# Altium project a5800-BONDPogo.PrjPcb
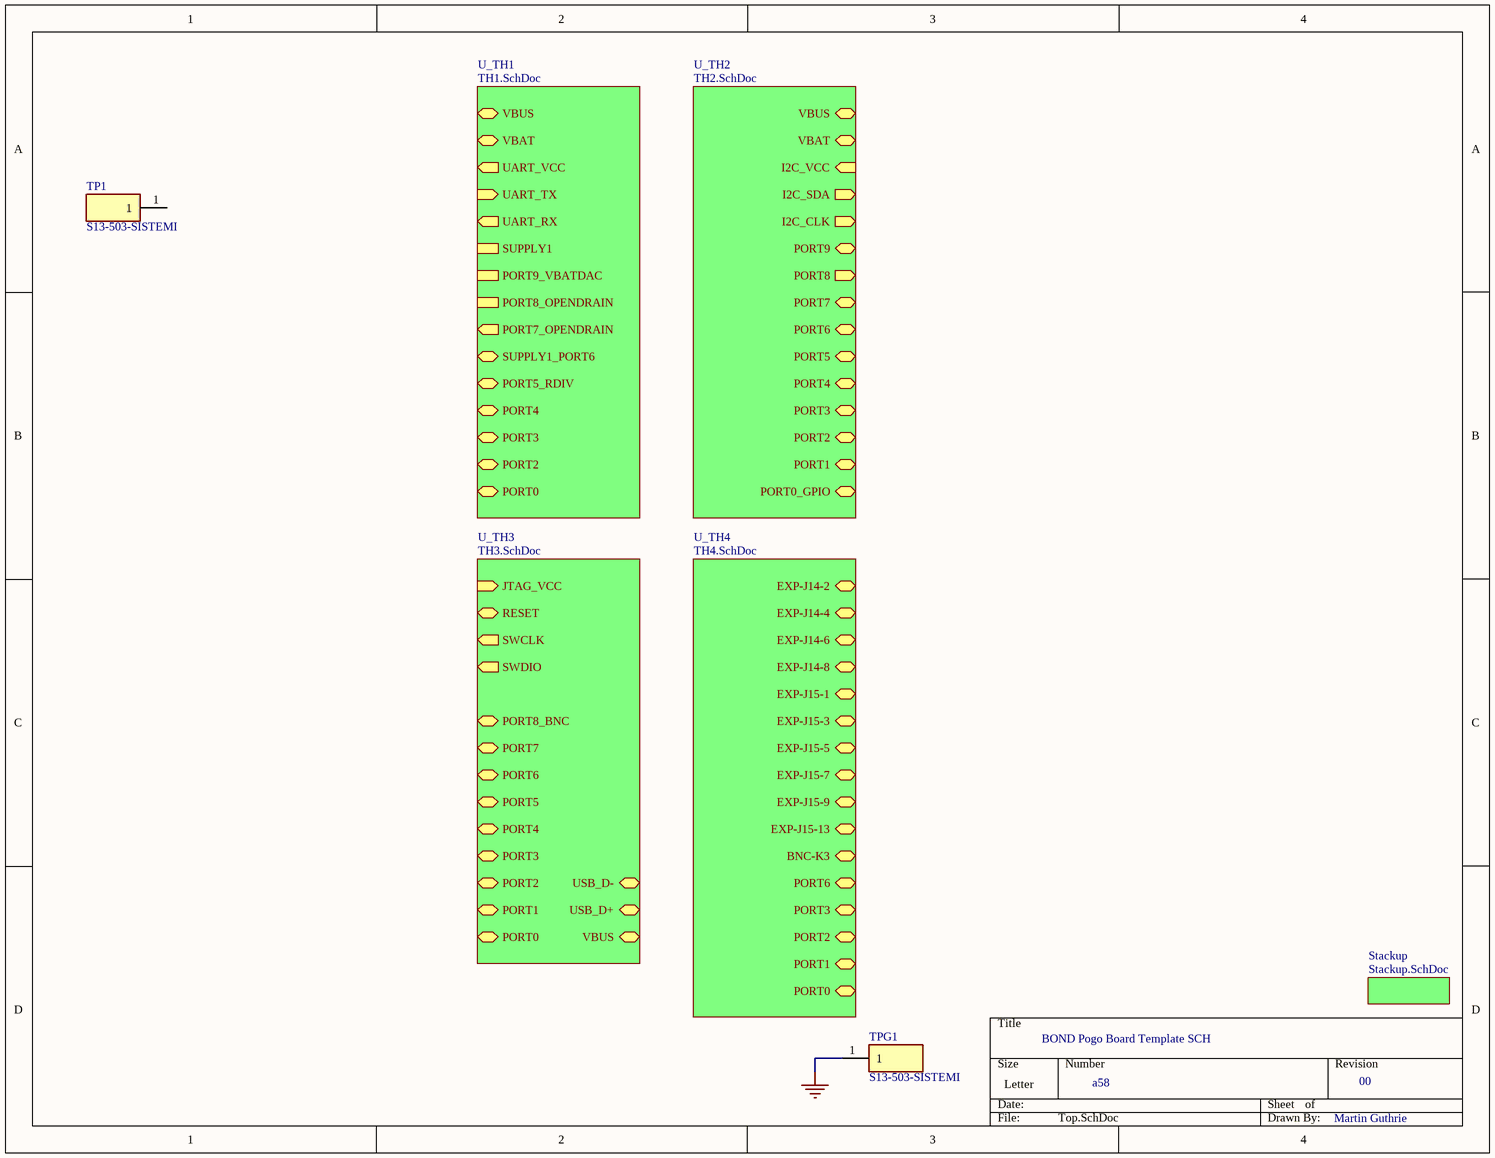
[diagram p0: Top.SchDoc]
6 sheets, 6 parts. Net scope: hierarchical (ports join the sheet entries above them; power ports are global).
Board file: Pcb.PcbDoc
Sheets:
  Top.SchDoc
    U_TH1 = TH1.SchDoc
    U_TH2 = TH2.SchDoc
    U_TH3 = TH3.SchDoc
    U_TH4 = TH4.SchDoc
    Stackup = Stackup.SchDoc

## Sheet Top.SchDoc
size Letter; SheetNumber: 1; SheetTotal: 6

### Parts
TP1  S13-503-SISTEMI  [CMP-001-0000-3]
TPG1  S13-503-SISTEMI  [CMP-001-0000-3]

### Sub-sheets
Stackup = Stackup.SchDoc: no entries
U_TH1 = TH1.SchDoc: VBUS (bidir), VBAT (bidir), UART_VCC (out), UART_TX (in), UART_RX (out), SUPPLY1_PORT6 (bidir), SUPPLY1, PORT9_VBATDAC, PORT8_OPENDRAIN, PORT7_OPENDRAIN (out), PORT5_RDIV (bidir), PORT4 (bidir), PORT3 (bidir), PORT2 (bidir), PORT0 (bidir)
U_TH2 = TH2.SchDoc: I2C_VCC (in), I2C_SDA (out), I2C_CLK (out), PORT6 (bidir), PORT0_GPIO (bidir), PORT1 (bidir), VBUS (bidir), PORT8 (out), PORT7 (bidir), PORT9 (bidir), PORT5 (bidir), PORT4 (bidir), PORT3 (bidir), PORT2 (bidir), VBAT (bidir)
U_TH3 = TH3.SchDoc: JTAG_VCC (in), SWDIO (out), SWCLK (out), RESET (bidir), PORT0 (bidir), PORT5 (bidir), USB_D- (bidir), PORT7 (bidir), PORT1 (bidir), PORT2 (bidir), PORT3 (bidir), PORT4 (bidir), VBUS (bidir), USB_D+ (bidir), PORT6 (bidir), PORT8_BNC (bidir)
U_TH4 = TH4.SchDoc: EXP-J14-2 (bidir), EXP-J14-4 (bidir), EXP-J14-6 (bidir), EXP-J14-8 (bidir), PORT0 (bidir), PORT1 (bidir), BNC-K3 (bidir), EXP-J15-1 (bidir), EXP-J15-3 (bidir), EXP-J15-5 (bidir), EXP-J15-7 (bidir), EXP-J15-9 (bidir), PORT3 (bidir), PORT2 (bidir), EXP-J15-13 (bidir), PORT6 (bidir)

### Nets
GND: TPG1.1

Not connected (* = marked no-connect by the designer): TP1 1

### Notes on the sheet
- BOND Pogo Board Template SCH
- a58
- 00
- Martin Guthrie

### Library data of the parts
TP1 = CMP-001-0000-3: Sistemi Version of Hirose S13-503
TPG1 = CMP-001-0000-3_GND: Sistemi Version of Hirose S13-503 (GND)

## Sheet TH1.SchDoc
size Letter; SheetNumber: 2; SheetTotal: 6
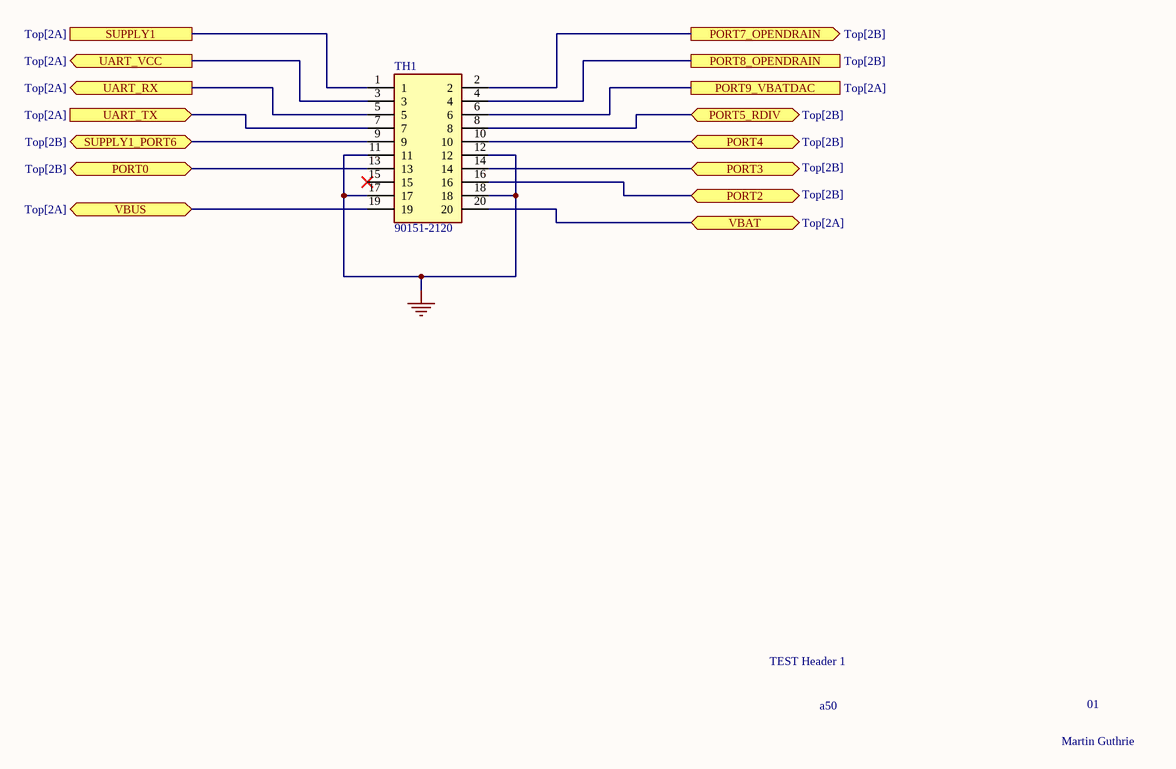
[diagram p1: TH1.SchDoc]

### Parts
TH1  90151-2120  [90151-2120]

### Ports
PORT0 (bidir, see Top[2B]), PORT2 (bidir, see Top[2B]), PORT3 (bidir, see Top[2B]), PORT4 (bidir, see Top[2B]), PORT5_RDIV (bidir, see Top[2B]), PORT7_OPENDRAIN (out, see Top[2B]), PORT8_OPENDRAIN (see Top[2B]), PORT9_VBATDAC (see Top[2A]), SUPPLY1 (see Top[2A]), SUPPLY1_PORT6 (bidir, see Top[2B]), UART_RX (out, see Top[2A]), UART_TX (in, see Top[2A]), UART_VCC (out, see Top[2A]), VBAT (bidir, see Top[2A]), VBUS (bidir, see Top[2A])

### Nets
GND: TH1.11 TH1.12 TH1.17 TH1.18
NetTH1_1: TH1.1 ; port SUPPLY1
NetTH1_2: TH1.2 ; port PORT7_OPENDRAIN
NetTH1_3: TH1.3 ; port UART_VCC
NetTH1_4: TH1.4 ; port PORT8_OPENDRAIN
NetTH1_5: TH1.5 ; port UART_RX
NetTH1_6: TH1.6 ; port PORT9_VBATDAC
NetTH1_7: TH1.7 ; port UART_TX
NetTH1_8: TH1.8 ; port PORT5_RDIV
NetTH1_9: TH1.9 ; port SUPPLY1_PORT6
NetTH1_10: TH1.10 ; port PORT4
NetTH1_13: TH1.13 ; port PORT0
NetTH1_14: TH1.14 ; port PORT3
NetTH1_16: TH1.16 ; port PORT2
NetTH1_19: TH1.19 ; port VBUS
NetTH1_20: TH1.20 ; port VBAT

Not connected (* = marked no-connect by the designer): TH1 15*

### Notes on the sheet
- TEST Header 1
- a50
- 01
- Martin Guthrie

### Library data of the parts
TH1 = 90151-2120: Connector; Manufacturer_Name: Molex; Datasheet Link: https://www.molex.com/pdm_docs/sd/901512120_sd.pdf; Height: 8.7mm; Manufacturer_Part_Number: 90151-2120; Mouser Part Number: 538-90151-2120; Mouser Price/Stock: https://www.mouser.co.uk/ProductDetail/Molex/90151-2120?qs=XmV31zLAuMHqFInYdcmaXg%3D%3D

## Sheet TH2.SchDoc
size Letter; SheetNumber: 3; SheetTotal: 6
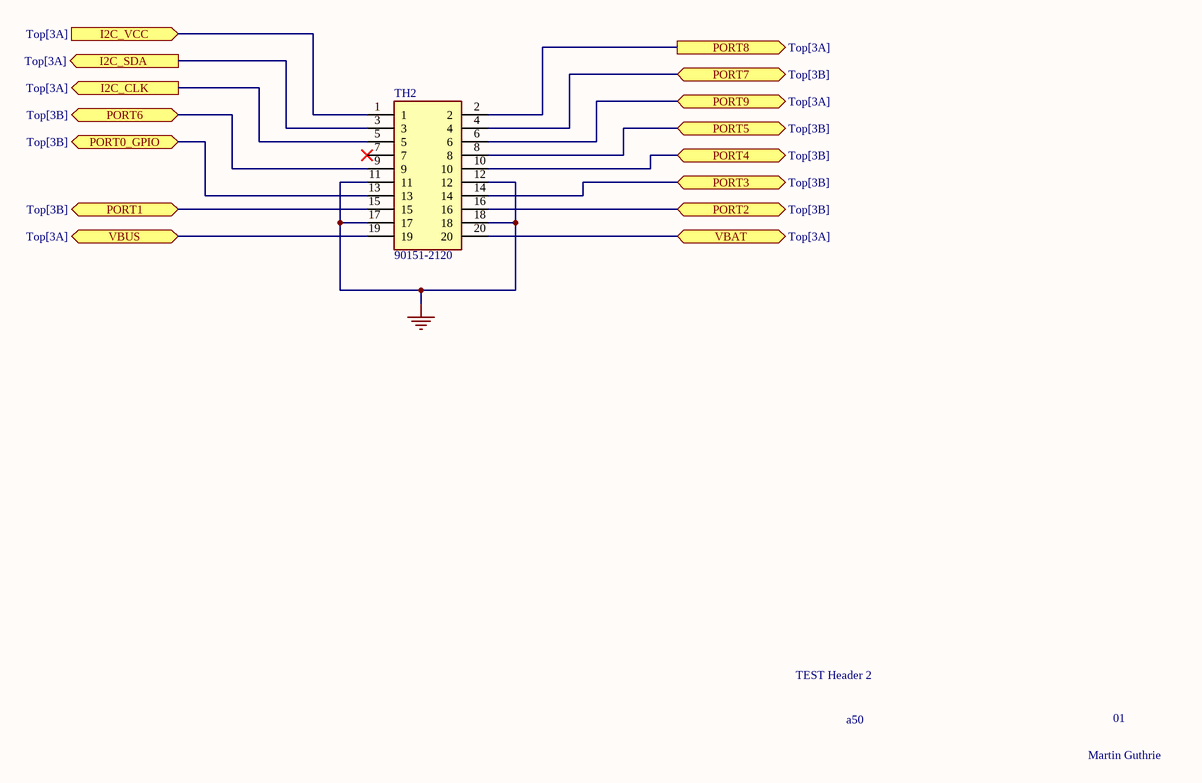
[diagram p2: TH2.SchDoc]

### Parts
TH2  90151-2120  [90151-2120]

### Ports
I2C_CLK (out, see Top[3A]), I2C_SDA (out, see Top[3A]), I2C_VCC (in, see Top[3A]), PORT0_GPIO (bidir, see Top[3B]), PORT1 (bidir, see Top[3B]), PORT2 (bidir, see Top[3B]), PORT3 (bidir, see Top[3B]), PORT4 (bidir, see Top[3B]), PORT5 (bidir, see Top[3B]), PORT6 (bidir, see Top[3B]), PORT7 (bidir, see Top[3B]), PORT8 (out, see Top[3A]), PORT9 (bidir, see Top[3A]), VBAT (bidir, see Top[3A]), VBUS (bidir, see Top[3A])

### Nets
GND: TH2.11 TH2.12 TH2.17 TH2.18
NetTH2_1: TH2.1 ; port I2C_VCC
NetTH2_2: TH2.2 ; port PORT8
NetTH2_3: TH2.3 ; port I2C_SDA
NetTH2_4: TH2.4 ; port PORT7
NetTH2_5: TH2.5 ; port I2C_CLK
NetTH2_6: TH2.6 ; port PORT9
NetTH2_8: TH2.8 ; port PORT5
NetTH2_9: TH2.9 ; port PORT6
NetTH2_10: TH2.10 ; port PORT4
NetTH2_13: TH2.13 ; port PORT0_GPIO
NetTH2_14: TH2.14 ; port PORT3
NetTH2_15: TH2.15 ; port PORT1
NetTH2_16: TH2.16 ; port PORT2
NetTH2_19: TH2.19 ; port VBUS
NetTH2_20: TH2.20 ; port VBAT

Not connected (* = marked no-connect by the designer): TH2 7*

### Notes on the sheet
- TEST Header 2
- a50
- 01
- Martin Guthrie

### Library data of the parts
TH2 = 90151-2120: Connector; Manufacturer_Name: Molex; Datasheet Link: https://www.molex.com/pdm_docs/sd/901512120_sd.pdf; Height: 8.7mm; Manufacturer_Part_Number: 90151-2120; Mouser Part Number: 538-90151-2120; Mouser Price/Stock: https://www.mouser.co.uk/ProductDetail/Molex/90151-2120?qs=XmV31zLAuMHqFInYdcmaXg%3D%3D

## Sheet TH3.SchDoc
size Letter; SheetNumber: 4; SheetTotal: 6
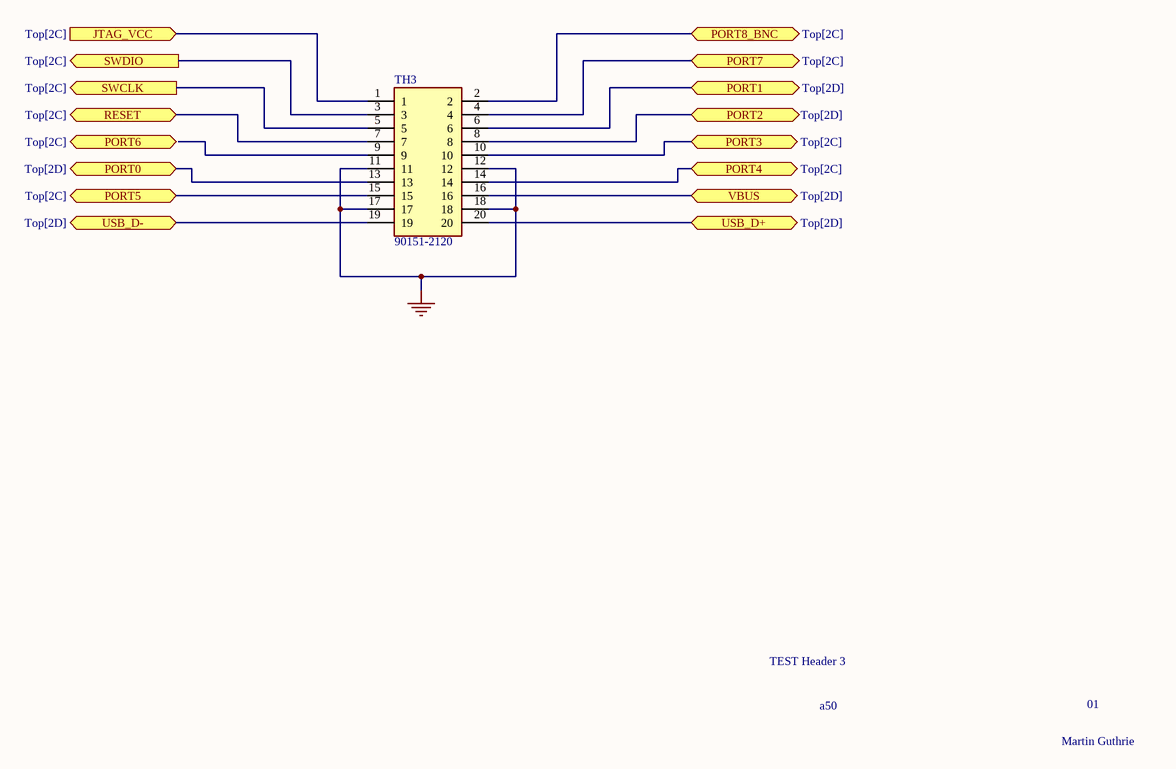
[diagram p3: TH3.SchDoc]

### Parts
TH3  90151-2120  [90151-2120]

### Ports
JTAG_VCC (in, see Top[2C]), PORT0 (bidir, see Top[2D]), PORT1 (bidir, see Top[2D]), PORT2 (bidir, see Top[2D]), PORT3 (bidir, see Top[2C]), PORT4 (bidir, see Top[2C]), PORT5 (bidir, see Top[2C]), PORT6 (bidir, see Top[2C]), PORT7 (bidir, see Top[2C]), PORT8_BNC (bidir, see Top[2C]), RESET (bidir, see Top[2C]), SWCLK (out, see Top[2C]), SWDIO (out, see Top[2C]), USB_D+ (bidir, see Top[2D]), USB_D- (bidir, see Top[2D]), VBUS (bidir, see Top[2D])

### Nets
GND: TH3.11 TH3.12 TH3.17 TH3.18
NetTH3_1: TH3.1 ; port JTAG_VCC
NetTH3_2: TH3.2 ; port PORT8_BNC
NetTH3_3: TH3.3 ; port SWDIO
NetTH3_4: TH3.4 ; port PORT7
NetTH3_5: TH3.5 ; port SWCLK
NetTH3_6: TH3.6 ; port PORT1
NetTH3_7: TH3.7 ; port RESET
NetTH3_8: TH3.8 ; port PORT2
NetTH3_10: TH3.10 ; port PORT3
NetTH3_13: TH3.13 ; port PORT0
NetTH3_14: TH3.14 ; port PORT4
NetTH3_15: TH3.15 ; port PORT5
NetTH3_16: TH3.16 ; port VBUS
NetTH3_19: TH3.19 ; port USB_D-
NetTH3_20: TH3.20 ; port USB_D+

Not connected (* = marked no-connect by the designer): TH3 9

### Notes on the sheet
- TEST Header 3
- a50
- 01
- Martin Guthrie

### Library data of the parts
TH3 = 90151-2120: Connector; Manufacturer_Name: Molex; Datasheet Link: https://www.molex.com/pdm_docs/sd/901512120_sd.pdf; Height: 8.7mm; Manufacturer_Part_Number: 90151-2120; Mouser Part Number: 538-90151-2120; Mouser Price/Stock: https://www.mouser.co.uk/ProductDetail/Molex/90151-2120?qs=XmV31zLAuMHqFInYdcmaXg%3D%3D

## Sheet TH4.SchDoc
size Letter; SheetNumber: 5; SheetTotal: 6
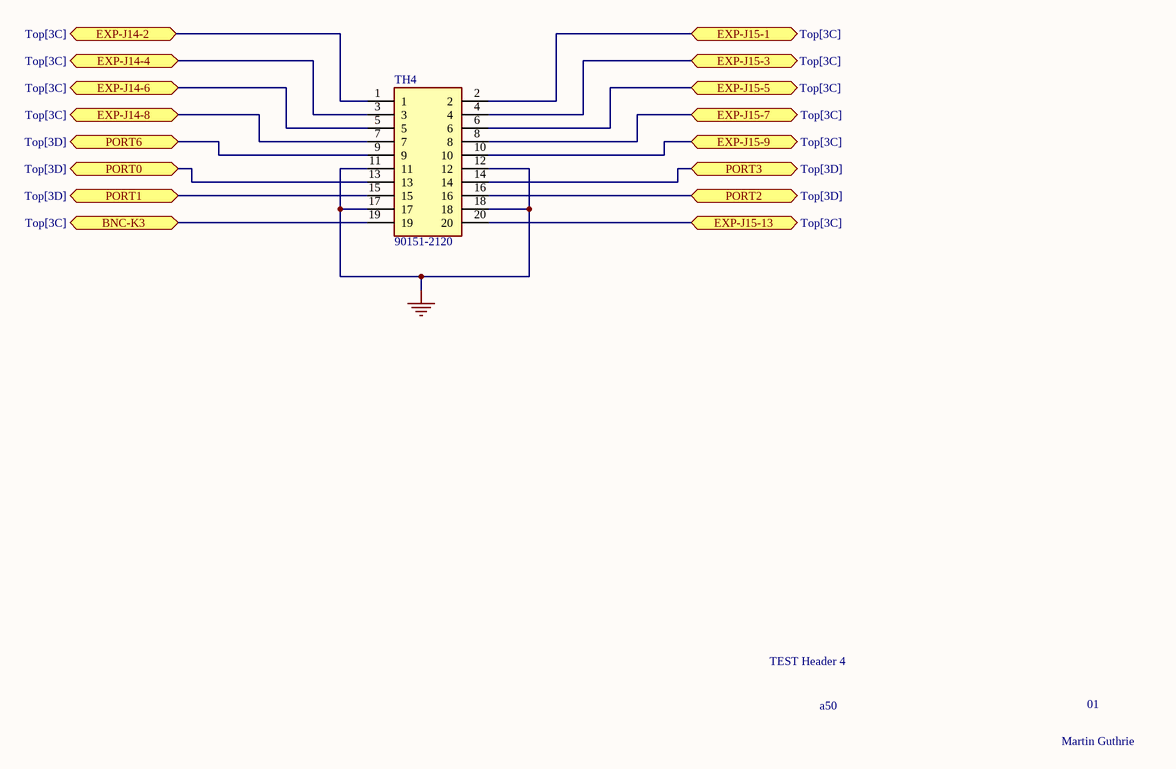
[diagram p4: TH4.SchDoc]

### Parts
TH4  90151-2120  [90151-2120]

### Ports
BNC-K3 (bidir, see Top[3C]), EXP-J14-2 (bidir, see Top[3C]), EXP-J14-4 (bidir, see Top[3C]), EXP-J14-6 (bidir, see Top[3C]), EXP-J14-8 (bidir, see Top[3C]), EXP-J15-1 (bidir, see Top[3C]), EXP-J15-3 (bidir, see Top[3C]), EXP-J15-5 (bidir, see Top[3C]), EXP-J15-7 (bidir, see Top[3C]), EXP-J15-9 (bidir, see Top[3C]), EXP-J15-13 (bidir, see Top[3C]), PORT0 (bidir, see Top[3D]), PORT1 (bidir, see Top[3D]), PORT2 (bidir, see Top[3D]), PORT3 (bidir, see Top[3D]), PORT6 (bidir, see Top[3D])

### Nets
GND: TH4.11 TH4.12 TH4.17 TH4.18
NetTH4_1: TH4.1 ; port EXP-J14-2
NetTH4_2: TH4.2 ; port EXP-J15-1
NetTH4_3: TH4.3 ; port EXP-J14-4
NetTH4_4: TH4.4 ; port EXP-J15-3
NetTH4_5: TH4.5 ; port EXP-J14-6
NetTH4_6: TH4.6 ; port EXP-J15-5
NetTH4_7: TH4.7 ; port EXP-J14-8
NetTH4_8: TH4.8 ; port EXP-J15-7
NetTH4_9: TH4.9 ; port PORT6
NetTH4_10: TH4.10 ; port EXP-J15-9
NetTH4_13: TH4.13 ; port PORT0
NetTH4_14: TH4.14 ; port PORT3
NetTH4_15: TH4.15 ; port PORT1
NetTH4_16: TH4.16 ; port PORT2
NetTH4_19: TH4.19 ; port BNC-K3
NetTH4_20: TH4.20 ; port EXP-J15-13

### Notes on the sheet
- TEST Header 4
- a50
- 01
- Martin Guthrie

### Library data of the parts
TH4 = 90151-2120: Connector; Manufacturer_Name: Molex; Datasheet Link: https://www.molex.com/pdm_docs/sd/901512120_sd.pdf; Height: 8.7mm; Manufacturer_Part_Number: 90151-2120; Mouser Part Number: 538-90151-2120; Mouser Price/Stock: https://www.mouser.co.uk/ProductDetail/Molex/90151-2120?qs=XmV31zLAuMHqFInYdcmaXg%3D%3D

## Sheet Stackup.SchDoc
size Letter; SheetNumber: 6; SheetTotal: 6
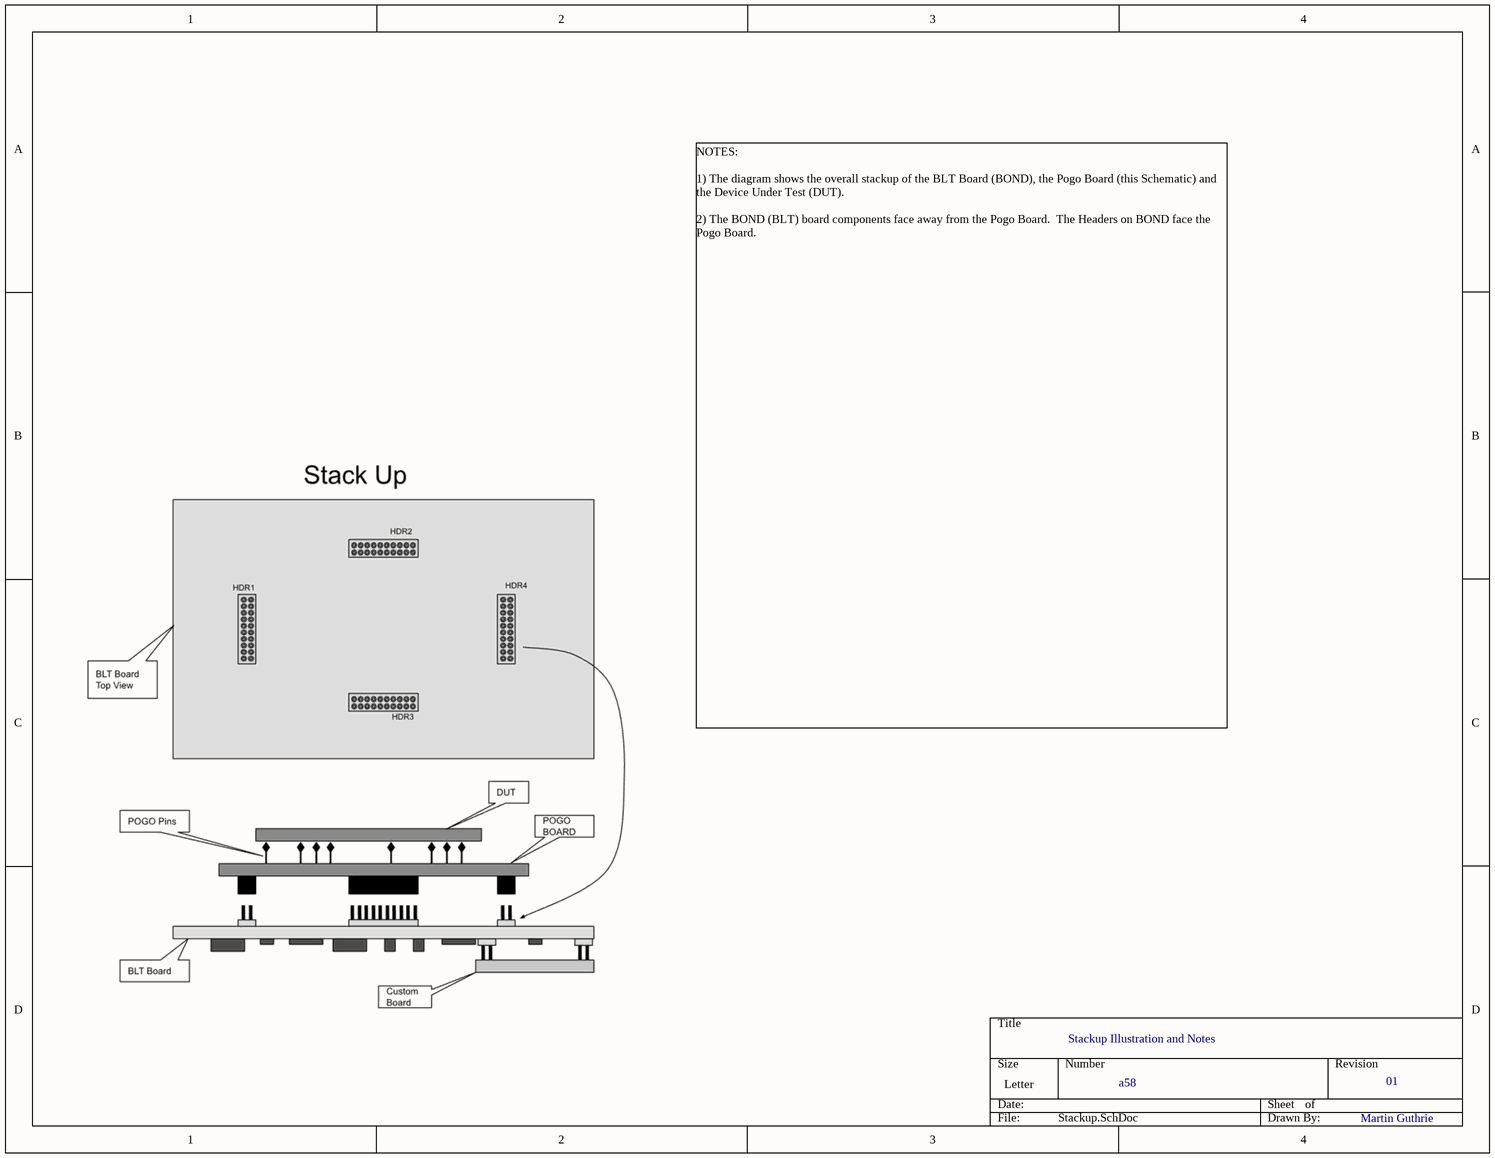
[diagram p5: Stackup.SchDoc]

### Notes on the sheet
- NOTES:
  1) The diagram shows the overall stackup of the BLT Board (BOND), the Pogo Board (this Schematic) and the Device Under Test (DUT).
  2) The BOND (BLT) board components face away from the Pogo Board.  The Headers on BOND face the Pogo Board.
- Stackup Illustration and Notes
- a58
- 01
- Martin Guthrie

## Nets that join several sheets
GND: Top (TPG1.1), TH1 (TH1.11 TH1.12 TH1.17 TH1.18), TH2 (TH2.11 TH2.12 TH2.17 TH2.18), TH3 (TH3.11 TH3.12 TH3.17 TH3.18), TH4 (TH4.11 TH4.12 TH4.17 TH4.18)